# EAGLE design BackPlane (EAGLE 9.6.2)
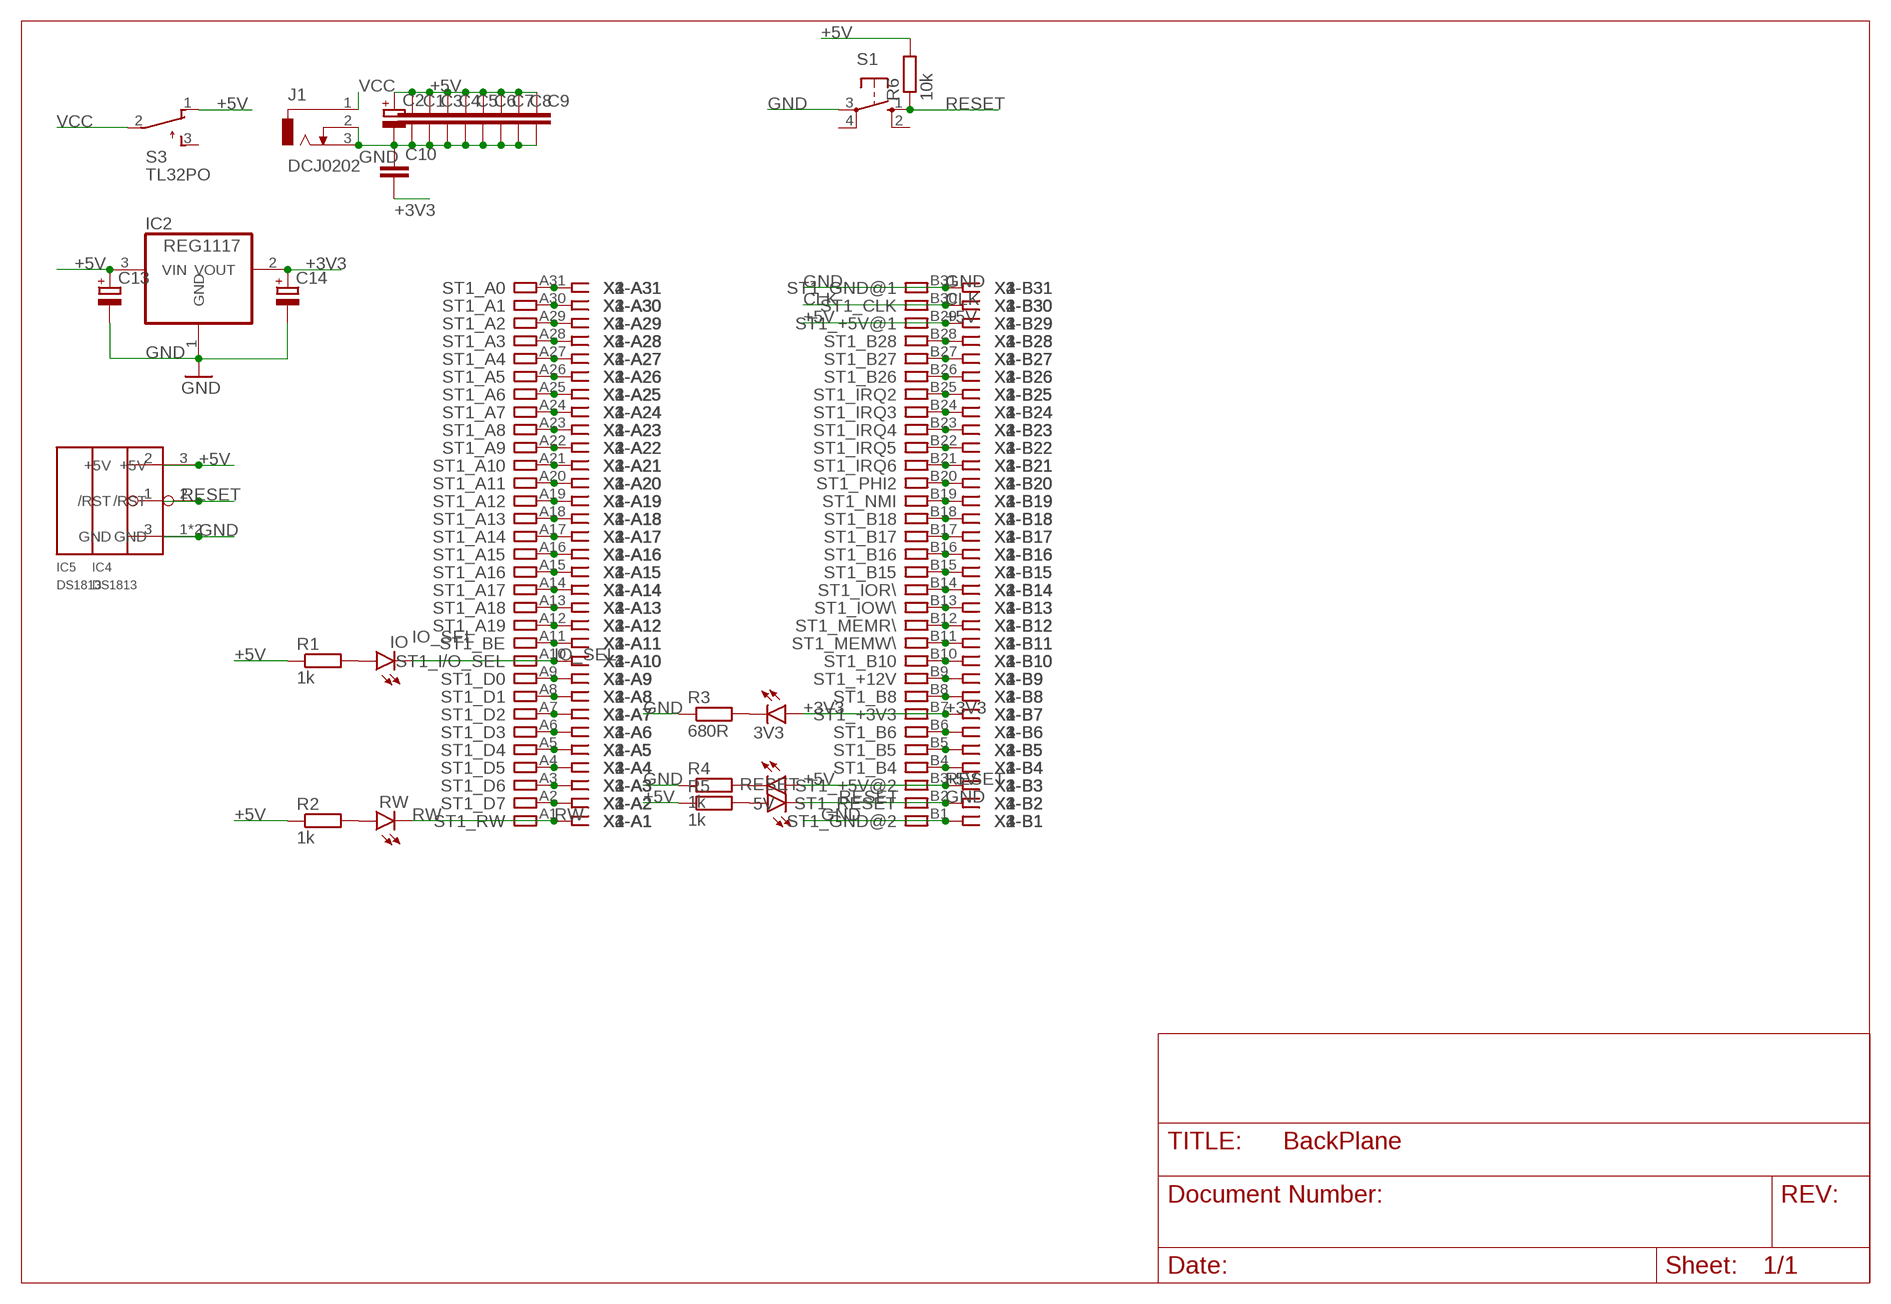
[diagram p0: schematic, sheet 1]

## Parts
3V3  LED3MM  [LED3MM]
5V  LED3MM  [LED3MM]
C1  C-EU050-024X044  [C050-024X044]
C2  CPOL-EUE3.5-8  [E3,5-8]
C3  C-EU050-024X044  [C050-024X044]
C4  C-EU050-024X044  [C050-024X044]
C5  C-EU050-024X044  [C050-024X044]
C6  C-EU050-024X044  [C050-024X044]
C7  C-EU050-024X044  [C050-024X044]
C8  C-EU050-024X044  [C050-024X044]
C9  C-EU050-024X044  [C050-024X044]
C10  C-EU025-024X044  [C025-024X044]
C13  CPOL-EUE2.5-5  [E2,5-5]
C14  CPOL-EUE2.5-5  [E2,5-5]
IC2  REG1117  [SOT223]
IC4  DS1813  DS1813SOT-223  [SOT223]
IC5  DS1813  [TO-92]
IO  LED3MM  [LED3MM]
J1  DCJ0202  [DCJ0202]
R1  1k  R-EU_0207/7  [0207/7]
R2  1k  R-EU_0207/7  [0207/7]
R3  680R  R-EU_0207/7  [0207/7]
R4  1k  R-EU_0207/7  [0207/7]
R5  1k  R-EU_0207/7  [0207/7]
R6  10k  R-EU_0207/7  [0207/7]
RESET  LED3MM  [LED3MM]
RW  LED3MM  [LED3MM]
S1  10-XX  [B3F-10XX]
S3  TL32PO  [TL3XPO]
ST1  IBM8BIT_ISASHORT  [APP_2X32_SHORT]
X1  ISA-SLOT  [ISA-8]
X2  ISA-SLOT  [ISA-8]
X3  ISA-SLOT  [ISA-8]
X4  ISA-SLOT  [ISA-8]

## Nets
+3V3: 3V3.A C10.2 C14.+ IC2.2(VOUT) ST1.B7 X1.B7 X2.B7 X3.B7 X4.B7
+5V: 5V.A C1.1 C2.+ C3.1 C4.1 C5.1 C6.1 C7.1 C8.1 C9.1 C13.+ IC2.3(VIN) IC4.3(+5V) IC5.2(+5V) R1.1 R2.1 R5.1 R6.2 S3.1(O) ST1.B3 ST1.B29 X1.B3 X1.B29 X2.B3 X2.B29 X3.B3 X3.B29 X4.B3 X4.B29
CLK: ST1.B30 X1.B30 X2.B30 X3.B30 X4.B30
GND: C1.2 C2.- C3.2 C4.2 C5.2 C6.2 C7.2 C8.2 C9.2 C10.1 C13.- C14.- IC2.1(GND) IC4.1(GND) IC4.4(GND) IC5.3(GND) J1.2 J1.3 R3.1 R4.1 S1.3(P) ST1.B1 ST1.B31 X1.B1 X1.B31 X2.B1 X2.B31 X3.B1 X3.B31 X4.B1 X4.B31
IO_SEL: IO.K(C) ST1.A10 X1.A10 X2.A10 X3.A10 X4.A10
N$1: IO.A R1.2
N$2: ST1.A2 X1.A2 X2.A2 X3.A2 X4.A2
N$3: ST1.A3 X1.A3 X2.A3 X3.A3 X4.A3
N$4: ST1.A4 X1.A4 X2.A4 X3.A4 X4.A4
N$5: ST1.A5 X1.A5 X2.A5 X3.A5 X4.A5
N$6: ST1.A6 X1.A6 X2.A6 X3.A6 X4.A6
N$7: ST1.A7 X1.A7 X2.A7 X3.A7 X4.A7
N$8: ST1.A8 X1.A8 X2.A8 X3.A8 X4.A8
N$9: ST1.A9 X1.A9 X2.A9 X3.A9 X4.A9
N$10: R2.2 RW.A
N$12: ST1.A11 X1.A11 X2.A11 X3.A11 X4.A11
N$13: ST1.A12 X1.A12 X2.A12 X3.A12 X4.A12
N$14: ST1.A13 X1.A13 X2.A13 X3.A13 X4.A13
N$15: ST1.A14 X1.A14 X2.A14 X3.A14 X4.A14
N$16: ST1.A15 X1.A15 X2.A15 X3.A15 X4.A15
N$17: ST1.A16 X1.A16 X2.A16 X3.A16 X4.A16
N$18: ST1.A17 X1.A17 X2.A17 X3.A17 X4.A17
N$19: ST1.A18 X1.A18 X2.A18 X3.A18 X4.A18
N$20: ST1.A19 X1.A19 X2.A19 X3.A19 X4.A19
N$21: ST1.A20 X1.A20 X2.A20 X3.A20 X4.A20
N$22: ST1.A21 X1.A21 X2.A21 X3.A21 X4.A21
N$23: ST1.A22 X1.A22 X2.A22 X3.A22 X4.A22
N$24: ST1.A23 X1.A23 X2.A23 X3.A23 X4.A23
N$25: ST1.A24 X1.A24 X2.A24 X3.A24 X4.A24
N$26: ST1.A25 X1.A25 X2.A25 X3.A25 X4.A25
N$27: ST1.A26 X1.A26 X2.A26 X3.A26 X4.A26
N$28: ST1.A27 X1.A27 X2.A27 X3.A27 X4.A27
N$29: ST1.A28 X1.A28 X2.A28 X3.A28 X4.A28
N$30: ST1.A29 X1.A29 X2.A29 X3.A29 X4.A29
N$31: ST1.A30 X1.A30 X2.A30 X3.A30 X4.A30
N$32: ST1.A31 X1.A31 X2.A31 X3.A31 X4.A31
N$35: ST1.B4 X1.B4 X2.B4 X3.B4 X4.B4
N$36: ST1.B5 X1.B5 X2.B5 X3.B5 X4.B5
N$37: ST1.B6 X1.B6 X2.B6 X3.B6 X4.B6
N$39: ST1.B8 X1.B8 X2.B8 X3.B8 X4.B8
N$40: ST1.B9 X1.B9 X2.B9 X3.B9 X4.B9
N$41: ST1.B10 X1.B10 X2.B10 X3.B10 X4.B10
N$42: ST1.B11 X1.B11 X2.B11 X3.B11 X4.B11
N$43: ST1.B12 X1.B12 X2.B12 X3.B12 X4.B12
N$44: ST1.B13 X1.B13 X2.B13 X3.B13 X4.B13
N$45: ST1.B14 X1.B14 X2.B14 X3.B14 X4.B14
N$46: ST1.B15 X1.B15 X2.B15 X3.B15 X4.B15
N$47: ST1.B16 X1.B16 X2.B16 X3.B16 X4.B16
N$48: ST1.B17 X1.B17 X2.B17 X3.B17 X4.B17
N$49: ST1.B18 X1.B18 X2.B18 X3.B18 X4.B18
N$50: ST1.B19 X1.B19 X2.B19 X3.B19 X4.B19
N$51: ST1.B20 X1.B20 X2.B20 X3.B20 X4.B20
N$52: ST1.B21 X1.B21 X2.B21 X3.B21 X4.B21
N$53: ST1.B22 X1.B22 X2.B22 X3.B22 X4.B22
N$54: ST1.B23 X1.B23 X2.B23 X3.B23 X4.B23
N$55: ST1.B24 X1.B24 X2.B24 X3.B24 X4.B24
N$56: ST1.B25 X1.B25 X2.B25 X3.B25 X4.B25
N$57: ST1.B26 X1.B26 X2.B26 X3.B26 X4.B26
N$58: ST1.B27 X1.B27 X2.B27 X3.B27 X4.B27
N$59: ST1.B28 X1.B28 X2.B28 X3.B28 X4.B28
N$63: 3V3.K(C) R3.2
N$64: 5V.K(C) R4.2
N$68: R5.2 RESET.A
RESET: IC4.2(/RST) IC5.1(/RST) R6.1 RESET.K(C) S1.1(S) ST1.B2 X1.B2 X2.B2 X3.B2 X4.B2
RW: RW.K(C) ST1.A1 X1.A1 X2.A1 X3.A1 X4.A1
VCC: J1.1 S3.2(P)
Unconnected: S1.2(S1) S1.4(P1) S3.3(S)

## Library data of the parts
3V3 5V IO RESET RW = led:LED: LED OSRAM: - CHIPLED LG R971, LG N971, LY N971, LG Q971, LY Q971, LO R971, LY R971 LH N974, LH R974 LS Q976, LO Q976, LY Q976 LO Q996 - Hyper CHIPLED LW Q18S LB Q993, LB Q99A, LB R99A - SideLED LS A670, LO A670, LY A670, LG A670, LP A670 LB A673, LV A673, LT A673, LW A673 LH A674 LY A675 LS A676, LA A676, LO A676, LY A676, LW A676 LS A679, LY A679, LG A679 - Hyper Micro SIDELED® LS Y876, LA Y876, LO Y876, LY Y876 LT Y87S - SmartLED LW L88C, LW L88S LB L89C, LB L89S, LG L890 LS L89K, LO L89K, LY L89K LS L896, LA L896, LO L896, LY L896 - TOPLED LS T670, LO T670, LY T670, LG T670, LP T670 LSG T670, LSP T670, LSY T670, LOP T670, LYG T670 LG T671, LOG T671, LSG T671 LB T673, LV T673, LT T673, LW T673 LH T674 LS T676, LA T676, LO T676, LY T676, LB T676, LH T676, LSB T676, LW T676 LB T67C, LV T67C, LT T67C, LS T67K, LO T67K, LY T67K, LW E67C LS E67B, LA E67B, LO E67B, LY E67B, LB E67C, LV E67C, LT E67C LW T67C LS T679, LY T679, LG T679 LS T770, LO T770, LY T770, LG T770, LP T770 LB T773, LV T773, LT T773, LW T773 LH T774 LS E675, LA E675, LY E675, LS T675 LS T776, LA T776, LO T776, LY T776, LB T776 LHGB T686 LT T68C, LB T68C - Hyper Mini TOPLED® LB M676 - Mini TOPLED Santana® LG M470 LS M47K, LO M47K, LY M47K Source: http://www.osram.convergy.de LUXEON: - LUMILED® LXK2-PW12-R00, LXK2-PW12-S00, LXK2-PW14-U00, LXK2-PW14-V00 LXK2-PM12-R00, LXK2-PM12-S00, LXK2-PM14-U00 LXK2-PE12-Q00, LXK2-PE12-R00, LXK2-PE12-S00, LXK2-PE14-T00, LXK2-PE14-U00 LXK2-PB12-K00, LXK2-PB12-L00, LXK2-PB12-M00, LXK2-PB14-N00, LXK2-PB14-P00, LXK2-PB14-Q00 LXK2-PR12-L00, LXK2-PR12-M00, LXK2-PR14-Q00, LXK2-PR14-R00 LXK2-PD12-Q00, LXK2-PD12-R00, LXK2-PD12-S00 LXK2-PH12-R00, LXK2-PH12-S00 LXK2-PL12-P00, LXK2-PL12-Q00, LXK2-PL12-R00 Source: www.luxeon.com KINGBRIGHT: KA-3528ASYC Source: www.kingbright.com
C1 C3-C10 = rcl:C-EU: CAPACITOR, European symbol; SPICEPREFIX: C
C2 C13 C14 = rcl:CPOL-EU: POLARIZED CAPACITOR, European symbol; SPICEPREFIX: C
IC2 = burr-brown:REG1117: 800mA and 1A Low Dropout (LDO) Positive Regulator 1.8V, 2.5V, 2.85V, 3.3V, 5V, and Adj; MPN: REG1117; OC_FARNELL: 1097566; OC_NEWARK: 14P6981
IC4 IC5 = ds1813_revised:DS1813
J1 = con-jack:DCJ0202: DC POWER JACK Source: DCJ0202.pdf; OC_FARNELL: unknown; OC_NEWARK: unknown
R1-R6 = rcl:R-EU_: RESISTOR, European symbol; SPICEPREFIX: R
S1 = switch-omron:10-XX: OMRON SWITCH; MPN: B3F-1000; OC_FARNELL: 176432; OC_NEWARK: 36M3542
S3 = switch:TL32PO: TINY SWITCH ON - MOM Source: http://www2.produktinfo.conrad.com/datenblaetter/700000-724999/705152-da-01-de-Subminiaturschalter_TL_36YO.pdf
ST1 = TiRoRiN_Libs:IBM8BIT_ISA: 8-bit CARD IBM/PC-AT
X1-X4 = TiRoRiN_Libs:ISA-SLOT: ISA SLOT

## Net classes
0 default: width 0.203 mm, drill 0.66 mm, clearance 0.254 mm
1 power: width 0.203 mm, drill 0.66 mm, clearance 0.254 mm to class 0, clearance 0.381 mm
2 data: width 0.381 mm, drill 0.66 mm, clearance 0.254 mm to class 0, clearance 0.254 mm to class 1, clearance 0.254 mm

## Board
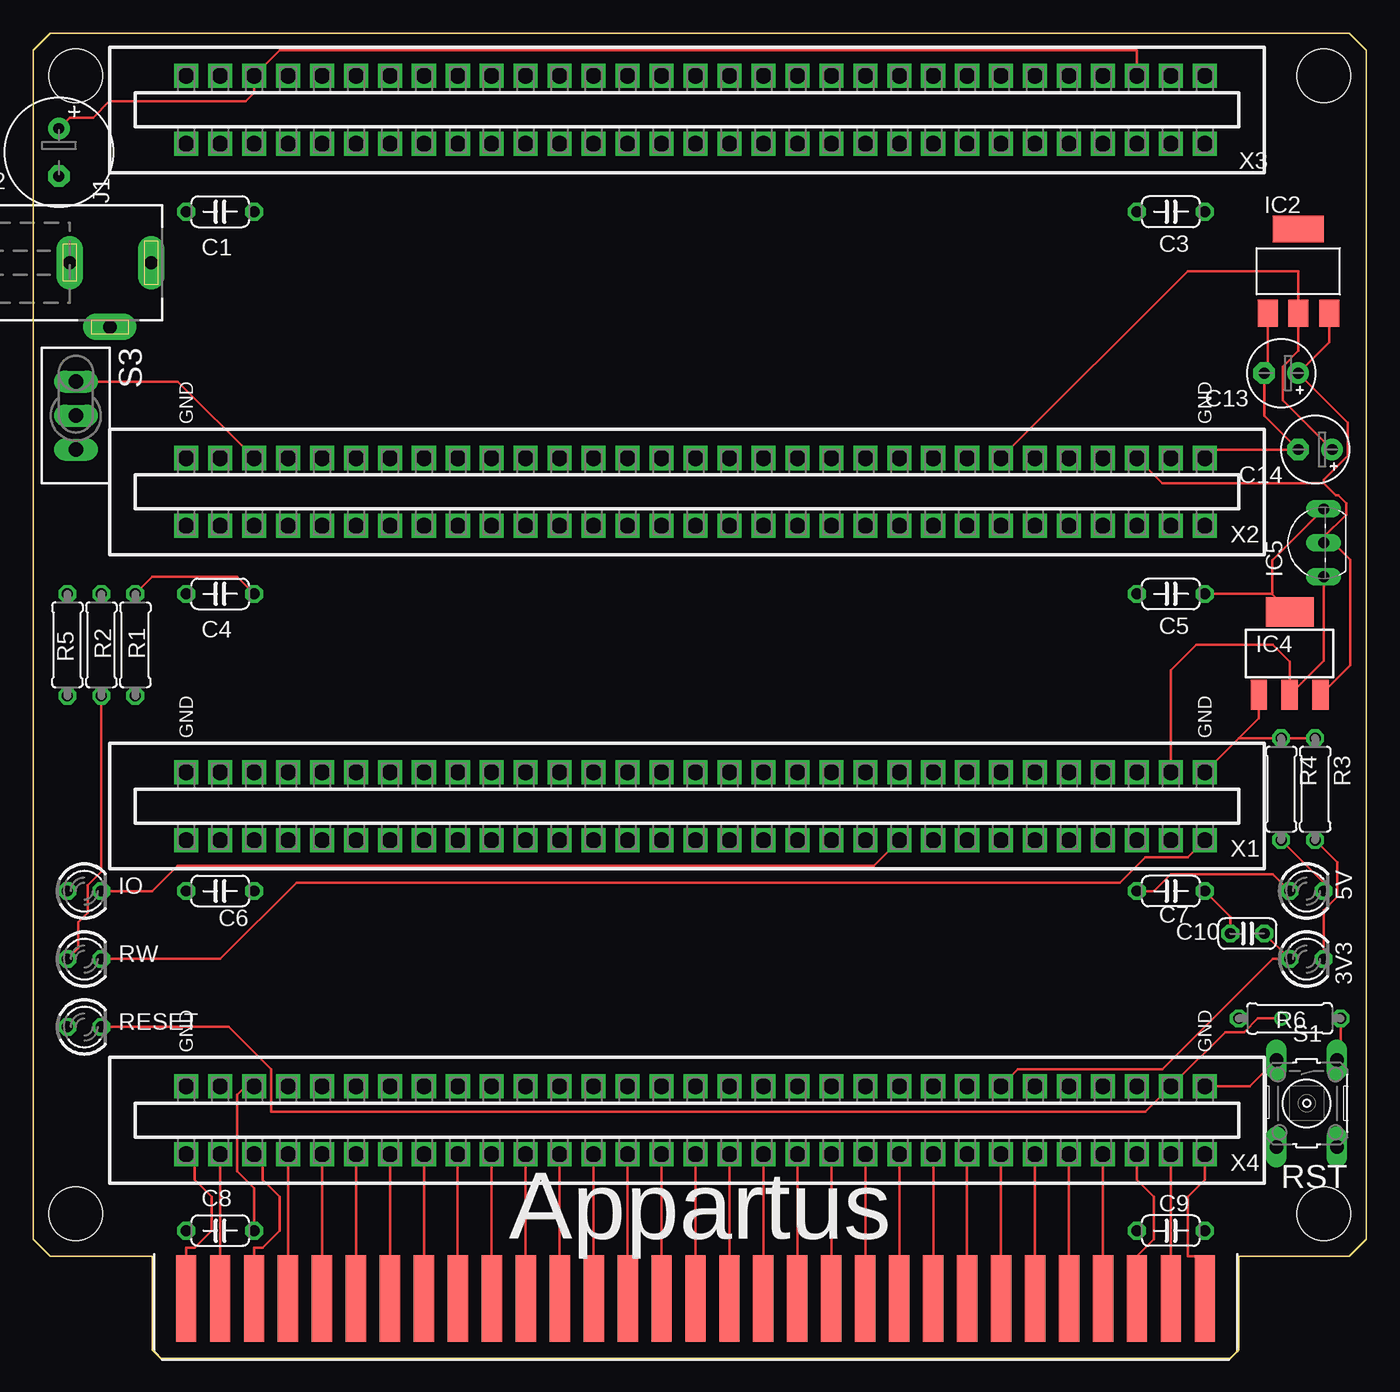
[diagram p1: board, top side]
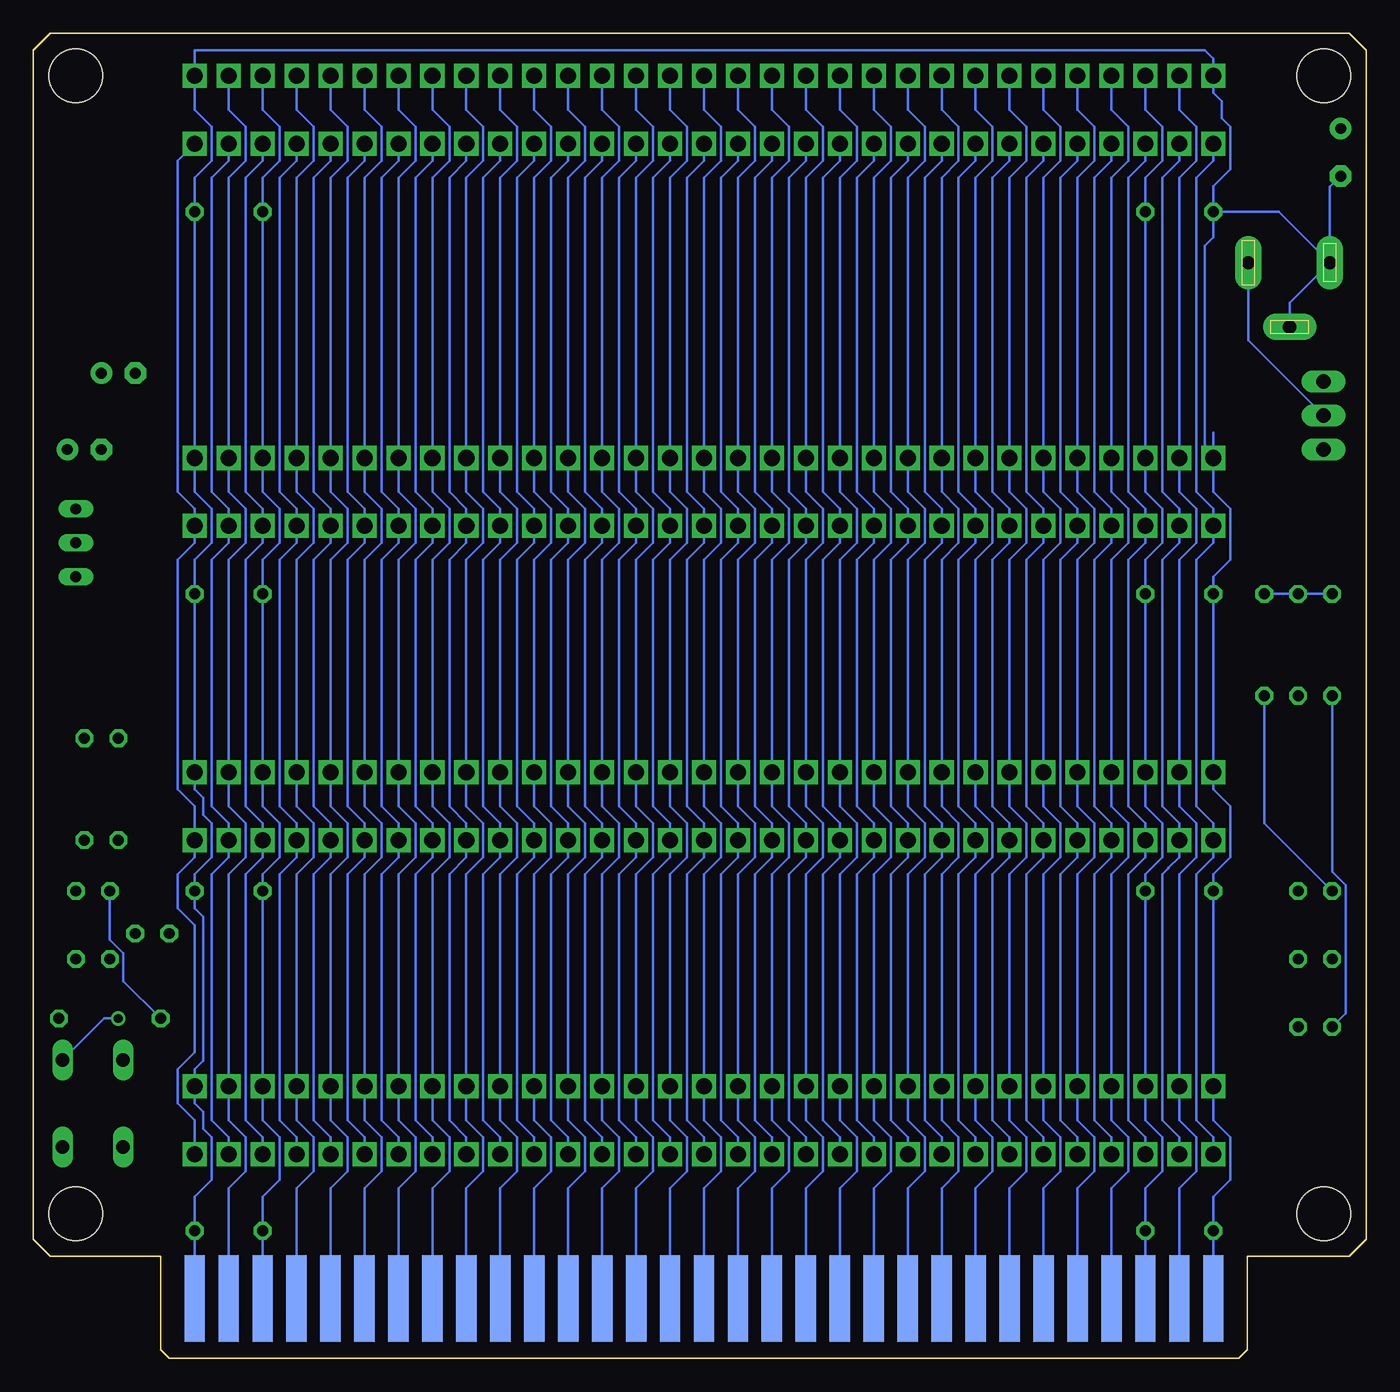
[diagram p2: board, bottom side, seen from below]

Size 99.69 x 99.06 mm. Coordinates in mm from the lower left corner, seen from the top.
Copper layers (1*16): Top 0.035mm / dielectric 1.5mm / Bottom 0.035mm
Design rules "default": minimum track width 6mil, minimum drill 0.35mm, track to track 6mil, track to pad 6mil, pad to pad 6mil, via to via 6mil, smd to smd 6mil, copper to edge 40mil, drill to drill 6mil, minimum pad ring 10mil, minimum via ring 8mil, stop-mask expansion 4mil, vias tented up to drill 0mil, thermal gap 10mil
Holes 4 mm at 3.17,95.88 96.52,95.88 96.52,10.8 3.17,10.8

### Footprints (pad centres in the part's own frame; a part is rotated, then mirrored left to right if it is on the bottom)
LED3MM = drill 0.813 octagon: A -1.27,0; K 1.27,0
C050-024X044 = drill 0.813 octagon: 1 -2.54,0; 2 2.54,0
E3,5-8 = drill 0.813 pad 1.6: + -1.778,0 | drill 0.813 pad 1.6 octagon: - 1.778,0
C025-024X044 = drill 0.813 octagon: 1 -1.27,0; 2 1.27,0
E2,5-5 = drill 0.813 pad 1.6: + -1.27,0 | drill 0.813 pad 1.6 octagon: - 1.27,0
SOT223 = smd 1.499 x 2.007: 1 -2.261,-3.15; 2 0.025,-3.15; 3 2.311,-3.15 | smd 3.81 x 2.007: 4 0,3.15
SOT223' = smd 1.219 x 2.235: 1 -2.311,-3.099; 2 0,-3.099; 3 2.311,-3.099 | smd 3.6 x 2.2: 4 0,3.099
TO-92 = drill 0.813 long: 1 -2.54,0; 2 0,0; 3 2.54,0
DCJ0202 = drill 1 pad 2 long: 1 0,3.1; 2 4.8,0; 3 0,-3
0207/7 = drill 0.813 octagon: 1 -3.81,0; 2 3.81,0
B3F-10XX = drill 1.016 long: 1 -3.251,2.261; 2 3.251,2.261; 3 -3.251,-2.261; 4 3.251,-2.261
TL3XPO = drill 1.1 pad 1.422 long: 1 -2.54,0; 2 0,0; 3 2.54,0
APP_2X32_SHORT = smd 1.524 x 6.477: A1 38.1,-44.45; A2 35.56,-44.45; A3 33.02,-44.45; A4 30.48,-44.45; A5 27.94,-44.45; A6 25.4,-44.45; A7 22.86,-44.45; A8 20.32,-44.45; A9 17.78,-44.45; A10 15.24,-44.45; A11 12.7,-44.45; A12 10.16,-44.45; A13 7.62,-44.45; A14 5.08,-44.45; A15 2.54,-44.45; A16 0,-44.45; A17 -2.54,-44.45; A18 -5.08,-44.45; A19 -7.62,-44.45; A20 -10.16,-44.45; A21 -12.7,-44.45; A22 -15.24,-44.45; A23 -17.78,-44.45; A24 -20.32,-44.45; A25 -22.86,-44.45; A26 -25.4,-44.45; A27 -27.94,-44.45; A28 -30.48,-44.45; A29 -33.02,-44.45; A30 -35.56,-44.45; A31 -38.1,-44.45 | smd 1.524 x 6.477 bottom: B1 38.1,-44.45; B2 35.56,-44.45; B3 33.02,-44.45; B4 30.48,-44.45; B5 27.94,-44.45; B6 25.4,-44.45; B7 22.86,-44.45; B8 20.32,-44.45; B9 17.78,-44.45; B10 15.24,-44.45; B11 12.7,-44.45; B12 10.16,-44.45; B13 7.62,-44.45; B14 5.08,-44.45; B15 2.54,-44.45; B16 0,-44.45; B17 -2.54,-44.45; B18 -5.08,-44.45; B19 -7.62,-44.45; B20 -10.16,-44.45; B21 -12.7,-44.45; B22 -15.24,-44.45; B23 -17.78,-44.45; B24 -20.32,-44.45; B25 -22.86,-44.45; B26 -25.4,-44.45; B27 -27.94,-44.45; B28 -30.48,-44.45; B29 -33.02,-44.45; B30 -35.56,-44.45; B31 -38.1,-44.45
ISA-8 = drill 1.2 pad 1.778 square: A1 40.64,-2.54; A2 38.1,-2.54; A3 35.56,-2.54; A4 33.02,-2.54; A5 30.48,-2.54; A6 27.94,-2.54; A7 25.4,-2.54; A8 22.86,-2.54; A9 20.32,-2.54; A10 17.78,-2.54; A11 15.24,-2.54; A12 12.7,-2.54; A13 10.16,-2.54; A14 7.62,-2.54; A15 5.08,-2.54; A16 2.54,-2.54; A17 0,-2.54; A18 -2.54,-2.54; A19 -5.08,-2.54; A20 -7.62,-2.54; A21 -10.16,-2.54; A22 -12.7,-2.54; A23 -15.24,-2.54; A24 -17.78,-2.54; A25 -20.32,-2.54; A26 -22.86,-2.54; A27 -25.4,-2.54; A28 -27.94,-2.54; A29 -30.48,-2.54; A30 -33.02,-2.54; A31 -35.56,-2.54; B1 40.64,2.54; B2 38.1,2.54; B3 35.56,2.54; B4 33.02,2.54; B5 30.48,2.54; B6 27.94,2.54; B7 25.4,2.54; B8 22.86,2.54; B9 20.32,2.54; B10 17.78,2.54; B11 15.24,2.54; B12 12.7,2.54; B13 10.16,2.54; B14 7.62,2.54; B15 5.08,2.54; B16 2.54,2.54; B17 0,2.54; B18 -2.54,2.54; B19 -5.08,2.54; B20 -7.62,2.54; B21 -10.16,2.54; B22 -12.7,2.54; B23 -15.24,2.54; B24 -17.78,2.54; B25 -20.32,2.54; B26 -22.86,2.54; B27 -25.4,2.54; B28 -27.94,2.54; B29 -30.48,2.54; B30 -33.02,2.54; B31 -35.56,2.54

### Placement (x,y rotation side)
3V3  95.25,29.84 0 top
5V  95.25,34.93 0 top
C1  13.97,85.72 180 top
C2  1.9,90.17 270 top
C3  85.09,85.72 0 top
C4  13.97,57.15 180 top
C5  85.09,57.15 0 top
C6  13.97,34.93 180 top
C7  85.09,34.93 0 top
C8  13.97,9.53 180 top
C9  85.09,9.53 0 top
C10  90.81,31.75 0 top
C13  93.34,73.66 180 top
C14  95.88,67.94 180 top
IC2  94.62,81.28 0 top
IC4  DS1813  [SOT223']  93.98,52.7 0 top
IC5  96.52,60.96 90 top
IO  3.81,34.93 0 top
J1  5.71,81.91 270 top
R1  7.62,53.34 270 top
R2  5.08,53.34 270 top
R3  95.88,42.55 270 top
R4  93.34,42.55 270 top
R5  2.54,53.34 270 top
R6  93.98,25.4 180 top
RESET  3.81,24.77 0 top
RW  3.81,29.84 0 top
S1  95.25,19.05 270 top
S3  3.17,70.49 270 top
ST1  49.53,48.9 0 top
X1  46.99,41.27 0 top
X2  46.99,64.77 0 top
X3  46.99,93.34 0 top
X4  46.99,17.78 0 top

### Tracks (layer width: path | path; a pad name or v marks a point on that pad's centre or on a via)
+3V3
  Top 0.203: X4.B7 73.66,21.59 84.46,21.59 92.71,29.84 3V3.A C10.2 | X2.B7 86.36,81.28 94.62,81.28 94.64,81.25 IC2.2 94.64,75.32 93.46,74.14 93.46,71.64 C14.+
  Bottom 0.203: ST1.B7 72.39,12.7 71.12,13.97 71.12,16.51 72.39,17.78 X4.B7 72.39,36.2 71.12,37.47 71.12,40.01 72.39,41.27 X1.B7 72.39,59.69 71.12,60.96 71.12,63.5 72.39,64.77 X2.B7 72.39,88.27 71.12,89.53 71.12,92.07 72.39,93.34 X3.B7
+5V
  Top 0.203: 5V.A 92.71,36.2 85.09,36.2 83.82,34.93 C7.1 | C8.1 16.51,12.7 15.24,13.97 15.24,19.69 15.88,20.32 X4.B29 | X3.B3 82.55,97.79 18.41,97.79 17.14,96.52 17.14,95.88 X3.B29 16.51,94.62 15.88,93.98 5.68,93.98 4.47,92.77 2.72,92.77 C2.+ | R1.1 8.89,58.42 15.24,58.42 C4.1 | IC2.3 96.93,75.97 C13.+ 98.31,69.96 98.31,67.47 96.52,65.68 96.52,65.41 | X2.B3 84.46,65.41 96.52,65.41 | S3.1 10.79,73.03 X2.B29 | 96.52,65.41 97.41,64.52 97.6,64.52 98.2,63.92 98.2,63.08 96.52,61.4 IC5.2 97.24,60.96 98.51,59.69 98.51,51.83 IC4.3
  Bottom 0.203: ST1.B3 C9.1 82.55,12.07 81.28,13.34 81.28,16.51 82.55,17.78 X4.B3 C7.1 82.55,36.2 81.28,37.47 81.28,40.01 82.55,41.27 X1.B3 C5.1 82.55,59.69 81.28,60.96 81.28,63.5 82.55,64.77 X2.B3 C3.1 82.55,88.27 81.28,89.53 81.28,92.07 82.55,93.34 X3.B3 | ST1.B29 16.51,12.7 15.24,13.97 15.24,16.51 16.51,17.78 X4.B29 C6.1 16.51,36.2 15.24,37.47 15.24,40.01 16.51,41.27 X1.B29 C4.1 16.51,59.69 15.24,60.96 15.24,63.5 16.51,64.77 X2.B29 C1.1 16.51,88.27 15.24,89.53 15.24,92.07 16.51,93.34 X3.B29 | R6.2 92.96,28.19 92.96,30.27 93.98,31.28 5V.A | R5.1 R2.1 R1.1
CLK
  Bottom 0.203: ST1.B30 13.97,12.7 12.7,13.97 12.7,16.51 13.97,17.78 X4.B30 13.97,36.2 12.7,37.47 12.7,40.01 13.97,41.27 X1.B30 13.97,59.69 12.7,60.96 12.7,63.5 13.97,64.77 X2.B30 13.97,88.27 12.7,89.53 12.7,92.07 13.97,93.34 X3.B30
GND
  Top 0.203: C7.2 89.53,33.02 C10.1 | S1.3 91.01,20.32 X4.B1 | IC2.1 92.35,73.94 C13.- 92.07,70.49 C14.- 88.26,67.94 X2.B1 | X1.B1 90.17,46.36 | 90.17,46.36 R4.1 R3.1 | C5.2 92.63,57.15 92.67,57.11 | 92.67,57.11 IC4.4 | IC5.3 92.67,59.65 92.67,57.11 | IC4.1 91.67,47.85 90.17,46.36
  Bottom 0.203: ST1.B31 C8.2 11.43,12.07 10.16,13.34 10.16,16.51 11.43,17.78 X4.B31 C6.2 11.43,36.2 10.16,37.47 10.16,41.27 11.43,42.55 X1.B31 C4.2 11.43,58.42 10.16,59.69 10.16,63.5 11.43,64.77 X2.B31 | X2.B31 11.43,69.22 | X2.B1 87.63,64.77 86.36,63.5 86.36,60.96 87.63,59.69 C5.2 X1.B1 87.63,42.55 87,41.91 87,40.64 86.36,40.01 86.36,37.47 87.63,36.2 C7.2 87.63,33.66 87,33.02 87,22.23 87.63,21.59 X4.B1 87.63,19.05 87,18.41 87,17.14 86.36,16.51 86.36,13.34 87.63,12.07 C9.2 ST1.B1 | X2.B1 87.63,67.94 | C1.2 11.43,87.63 10.16,88.9 10.16,92.07 10.79,92.71 10.79,93.98 11.43,94.62 X3.B31 11.43,97.16 12.06,97.79 87.63,97.79 X3.B1 87.63,93.34 86.36,92.07 86.36,89.53 87.63,88.27 C3.2 X2.B1 | X2.B31 12.06,67.94 12.06,83.19 11.43,83.82 C1.2 | J1.2 5.71,78.91 J1.3 | J1.3 2.71,87.58 C2.- | J1.3 6.52,85.72 C1.2
IO_SEL
  Top 0.203: IO.K 8.89,34.93 10.79,36.83 62.87,36.83 X1.A10 | X4.A10 ST1.A10
  Bottom 0.203: X4.A10 64.77,16.51 66.04,17.78 66.04,36.2 64.77,37.47 X1.A10 64.77,40.01 66.04,41.27 66.04,59.69 64.77,60.96 X2.A10 64.77,63.5 66.04,64.77 66.04,88.27 64.77,89.53 X3.A10
N$1
  Bottom 0.203: R1.2 7.62,40.01 IO.A
N$2
  Top 0.203: X4.A2 ST1.A2
  Bottom 0.203: X4.A2 85.09,16.51 86.36,17.78 86.36,36.2 85.09,37.47 X1.A2 85.09,40.01 86.36,41.27 86.36,59.69 85.09,60.96 X2.A2 85.09,63.5 86.36,64.77 86.36,88.27 85.09,89.53 X3.A2
N$3
  Top 0.203: ST1.A3 82.55,7.62 83.82,8.89 83.82,12.07 82.55,13.34 X4.A3
  Bottom 0.203: X4.A3 82.55,16.51 83.82,17.78 83.82,36.2 82.55,37.47 X1.A3 82.55,40.01 83.82,41.27 83.82,59.69 82.55,60.96 X2.A3 82.55,63.5 83.82,64.77 83.82,88.27 82.55,89.53 X3.A3
N$4
  Top 0.203: X4.A4 ST1.A4
  Bottom 0.203: X4.A4 80.01,16.51 81.28,17.78 81.28,36.2 80.01,37.47 X1.A4 80.01,40.01 81.28,41.27 81.28,59.69 80.01,60.96 X2.A4 80.01,63.5 81.28,64.77 81.28,88.27 80.01,89.53 X3.A4
N$5
  Top 0.203: X4.A5 ST1.A5
  Bottom 0.203: X4.A5 77.47,16.51 78.74,17.78 78.74,36.2 77.47,37.47 X1.A5 77.47,40.01 78.74,41.27 78.74,59.69 77.47,60.96 X2.A5 77.47,63.5 78.74,64.77 78.74,88.27 77.47,89.53 X3.A5
N$6
  Top 0.203: X4.A6 ST1.A6
  Bottom 0.203: X4.A6 74.93,16.51 76.2,17.78 76.2,36.2 74.93,37.47 X1.A6 74.93,40.01 76.2,41.27 76.2,59.69 74.93,60.96 X2.A6 74.93,63.5 76.2,64.77 76.2,88.27 74.93,89.53 X3.A6
N$7
  Top 0.203: X4.A7 ST1.A7
  Bottom 0.203: X4.A7 72.39,16.51 73.66,17.78 73.66,36.2 72.39,37.47 X1.A7 72.39,40.01 73.66,41.27 73.66,59.69 72.39,60.96 X2.A7 72.39,63.5 73.66,64.77 73.66,88.27 72.39,89.53 X3.A7
N$8
  Top 0.203: X4.A8 ST1.A8
  Bottom 0.203: X4.A8 69.85,16.51 71.12,17.78 71.12,36.2 69.85,37.47 X1.A8 69.85,40.01 71.12,41.27 71.12,59.69 69.85,60.96 X2.A8 69.85,63.5 71.12,64.77 71.12,88.27 69.85,89.53 X3.A8
N$9
  Top 0.203: X4.A9 ST1.A9
  Bottom 0.203: X4.A9 67.31,16.51 68.58,17.78 68.58,36.2 67.31,37.47 X1.A9 67.31,40.01 68.58,41.27 68.58,59.69 67.31,60.96 X2.A9 67.31,63.5 68.58,64.77 68.58,88.27 67.31,89.53 X3.A9
N$10
  Top 0.203: RW.A 3.35,30.66 3.35,32.57 4.06,33.29 4.06,35.35 5.08,36.36 R2.2
N$12
  Top 0.203: X4.A11 ST1.A11
  Bottom 0.203: X4.A11 62.23,16.51 63.5,17.78 63.5,36.2 62.23,37.47 X1.A11 62.23,40.01 63.5,41.27 63.5,59.69 62.23,60.96 X2.A11 62.23,63.5 63.5,64.77 63.5,88.27 62.23,89.53 X3.A11
N$13
  Top 0.203: X4.A12 ST1.A12
  Bottom 0.203: X4.A12 59.69,16.51 60.96,17.78 60.96,36.2 59.69,37.47 X1.A12 59.69,40.01 60.96,41.27 60.96,59.69 59.69,60.96 X2.A12 59.69,63.5 60.96,64.77 60.96,88.27 59.69,89.53 X3.A12
N$14
  Top 0.203: X4.A13 ST1.A13
  Bottom 0.203: X4.A13 57.15,16.51 58.42,17.78 58.42,36.2 57.15,37.47 X1.A13 57.15,40.01 58.42,41.27 58.42,59.69 57.15,60.96 X2.A13 57.15,63.5 58.42,64.77 58.42,88.27 57.15,89.53 X3.A13
N$15
  Top 0.203: X4.A14 ST1.A14
  Bottom 0.203: X4.A14 54.61,16.51 55.88,17.78 55.88,36.2 54.61,37.47 X1.A14 54.61,40.01 55.88,41.27 55.88,59.69 54.61,60.96 X2.A14 54.61,63.5 55.88,64.77 55.88,88.27 54.61,89.53 X3.A14
N$16
  Top 0.203: X4.A15 ST1.A15
  Bottom 0.203: X4.A15 52.07,16.51 53.34,17.78 53.34,36.2 52.07,37.47 X1.A15 52.07,40.01 53.34,41.27 53.34,59.69 52.07,60.96 X2.A15 52.07,63.5 53.34,64.77 53.34,88.27 52.07,89.53 X3.A15
N$17
  Top 0.203: X4.A16 ST1.A16
  Bottom 0.203: X4.A16 49.53,16.51 50.8,17.78 50.8,36.2 49.53,37.47 X1.A16 49.53,40.01 50.8,41.27 50.8,59.69 49.53,60.96 X2.A16 49.53,63.5 50.8,64.77 50.8,88.27 49.53,89.53 X3.A16
N$18
  Top 0.203: X4.A17 ST1.A17
  Bottom 0.203: X4.A17 46.99,16.51 48.26,17.78 48.26,36.2 46.99,37.47 X1.A17 46.99,40.01 48.26,41.27 48.26,59.69 46.99,60.96 X2.A17 46.99,63.5 48.26,64.77 48.26,88.27 46.99,89.53 X3.A17
N$19
  Top 0.203: X4.A18 ST1.A18
  Bottom 0.203: X4.A18 44.45,16.51 45.72,17.78 45.72,36.2 44.45,37.47 X1.A18 44.45,40.01 45.72,41.27 45.72,59.69 44.45,60.96 X2.A18 44.45,63.5 45.72,64.77 45.72,88.27 44.45,89.53 X3.A18
N$20
  Top 0.203: X4.A19 ST1.A19
  Bottom 0.203: X4.A19 41.91,16.51 43.18,17.78 43.18,36.2 41.91,37.47 X1.A19 41.91,40.01 43.18,41.27 43.18,59.69 41.91,60.96 X2.A19 41.91,63.5 43.18,64.77 43.18,88.27 41.91,89.53 X3.A19
N$21
  Top 0.203: X4.A20 ST1.A20
  Bottom 0.203: X4.A20 39.37,16.51 40.64,17.78 40.64,36.2 39.37,37.47 X1.A20 39.37,40.01 40.64,41.27 40.64,59.69 39.37,60.96 X2.A20 39.37,63.5 40.64,64.77 40.64,88.27 39.37,89.53 X3.A20
N$22
  Top 0.203: X4.A21 ST1.A21
  Bottom 0.203: X4.A21 36.83,16.51 38.1,17.78 38.1,36.2 36.83,37.47 X1.A21 36.83,40.01 38.1,41.27 38.1,59.69 36.83,60.96 X2.A21 36.83,63.5 38.1,64.77 38.1,88.27 36.83,89.53 X3.A21
N$23
  Top 0.203: X4.A22 ST1.A22
  Bottom 0.203: X4.A22 34.29,16.51 35.56,17.78 35.56,36.2 34.29,37.47 X1.A22 34.29,40.01 35.56,41.27 35.56,59.69 34.29,60.96 X2.A22 34.29,63.5 35.56,64.77 35.56,88.27 34.29,89.53 X3.A22
N$24
  Top 0.203: X4.A23 ST1.A23
  Bottom 0.203: X4.A23 31.75,16.51 33.02,17.78 33.02,36.2 31.75,37.47 X1.A23 31.75,40.01 33.02,41.27 33.02,59.69 31.75,60.96 X2.A23 31.75,63.5 33.02,64.77 33.02,88.27 31.75,89.53 X3.A23
N$25
  Top 0.203: X4.A24 ST1.A24
  Bottom 0.203: X4.A24 29.21,16.51 30.48,17.78 30.48,36.2 29.21,37.47 X1.A24 29.21,40.01 30.48,41.27 30.48,59.69 29.21,60.96 X2.A24 29.21,63.5 30.48,64.77 30.48,88.27 29.21,89.53 X3.A24
N$26
  Top 0.203: X4.A25 ST1.A25
  Bottom 0.203: X4.A25 26.67,16.51 27.94,17.78 27.94,36.2 26.67,37.47 X1.A25 26.67,40.01 27.94,41.27 27.94,59.69 26.67,60.96 X2.A25 26.67,63.5 27.94,64.77 27.94,88.27 26.67,89.53 X3.A25
N$27
  Top 0.203: X4.A26 ST1.A26
  Bottom 0.203: X4.A26 24.13,16.51 25.4,17.78 25.4,36.2 24.13,37.47 X1.A26 24.13,40.01 25.4,41.27 25.4,59.69 24.13,60.96 X2.A26 24.13,63.5 25.4,64.77 25.4,88.27 24.13,89.53 X3.A26
N$28
  Top 0.203: X4.A27 ST1.A27
  Bottom 0.203: X4.A27 21.59,16.51 22.86,17.78 22.86,36.2 21.59,37.47 X1.A27 21.59,40.01 22.86,41.27 22.86,59.69 21.59,60.96 X2.A27 21.59,63.5 22.86,64.77 22.86,88.27 21.59,89.53 X3.A27
N$29
  Top 0.203: X4.A28 ST1.A28
  Bottom 0.203: X4.A28 19.05,16.51 20.32,17.78 20.32,36.2 19.05,37.47 X1.A28 19.05,40.01 20.32,41.27 20.32,59.69 19.05,60.96 X2.A28 19.05,63.5 20.32,64.77 20.32,88.27 19.05,89.53 X3.A28
N$30
  Top 0.203: ST1.A29 16.51,8.26 17.14,8.26 18.41,9.53 18.41,12.07 17.14,13.34 17.14,15.24 X4.A29
  Bottom 0.203: X4.A29 16.51,16.51 17.78,17.78 17.78,36.2 16.51,37.47 X1.A29 16.51,40.01 17.78,41.27 17.78,59.69 16.51,60.96 X2.A29 16.51,63.5 17.78,64.77 17.78,88.27 16.51,89.53 X3.A29
N$31
  Top 0.203: X4.A30 ST1.A30
  Bottom 0.203: X4.A30 13.97,16.51 15.24,17.78 15.24,36.18 14.78,36.64 14.78,36.65 13.97,37.47 X1.A30 13.97,40.01 15.24,41.27 15.24,59.69 13.97,60.96 X2.A30 13.97,63.5 15.24,64.77 15.24,88.27 13.97,89.53 X3.A30
N$32
  Top 0.203: ST1.A31 11.43,8.26 12.06,8.26 13.33,9.53 13.33,12.07 12.06,13.34 12.06,15.24 X4.A31
  Bottom 0.203: X4.A31 11.43,16.51 12.7,17.78 12.7,36.2 11.43,37.47 X1.A31 11.43,40.01 12.7,41.27 12.7,59.69 11.43,60.96 X2.A31 11.43,63.5 12.7,64.77 12.7,88.27 11.43,89.53 X3.A31
N$35
  Bottom 0.203: ST1.B4 80.01,12.7 78.74,13.97 78.74,16.51 80.01,17.78 X4.B4 80.01,36.2 78.74,37.47 78.74,40.01 80.01,41.27 X1.B4 80.01,59.69 78.74,60.96 78.74,63.5 80.01,64.77 X2.B4 80.01,88.27 78.74,89.53 78.74,92.07 80.01,93.34 X3.B4
N$36
  Bottom 0.203: ST1.B5 77.47,12.7 76.2,13.97 76.2,16.51 77.47,17.78 X4.B5 77.47,36.2 76.2,37.47 76.2,40.01 77.47,41.27 X1.B5 77.47,59.69 76.2,60.96 76.2,63.5 77.47,64.77 X2.B5 77.47,88.27 76.2,89.53 76.2,92.07 77.47,93.34 X3.B5
N$37
  Bottom 0.203: ST1.B6 74.93,12.7 73.66,13.97 73.66,16.51 74.93,17.78 X4.B6 74.93,36.2 73.66,37.47 73.66,40.01 74.93,41.27 X1.B6 74.93,59.69 73.66,60.96 73.66,63.5 74.93,64.77 X2.B6 74.93,88.27 73.66,89.53 73.66,92.07 74.93,93.34 X3.B6
N$39
  Bottom 0.203: ST1.B8 69.85,12.7 68.58,13.97 68.58,16.51 69.85,17.78 X4.B8 69.85,36.2 68.58,37.47 68.58,40.01 69.85,41.27 X1.B8 69.85,59.69 68.58,60.96 68.58,63.5 69.85,64.77 X2.B8 69.85,88.27 68.58,89.53 68.58,92.07 69.85,93.34 X3.B8
N$40
  Bottom 0.203: ST1.B9 67.31,12.7 66.04,13.97 66.04,16.51 67.31,17.78 X4.B9 67.31,36.2 66.04,37.47 66.04,40.01 67.31,41.27 X1.B9 67.31,59.69 66.04,60.96 66.04,63.5 67.31,64.77 X2.B9 67.31,88.27 66.04,89.53 66.04,92.07 67.31,93.34 X3.B9
N$41
  Bottom 0.203: ST1.B10 64.77,12.7 63.5,13.97 63.5,16.51 64.77,17.78 X4.B10 64.77,36.2 63.5,37.47 63.5,40.01 64.77,41.27 X1.B10 64.77,59.69 63.5,60.96 63.5,63.5 64.77,64.77 X2.B10 64.77,88.27 63.5,89.53 63.5,92.07 64.77,93.34 X3.B10
N$42
  Bottom 0.203: ST1.B11 62.23,12.7 60.96,13.97 60.96,16.51 62.23,17.78 X4.B11 62.23,36.2 60.96,37.47 60.96,40.01 62.23,41.27 X1.B11 62.23,59.69 60.96,60.96 60.96,63.5 62.23,64.77 X2.B11 62.23,88.27 60.96,89.53 60.96,92.07 62.23,93.34 X3.B11
N$43
  Bottom 0.203: ST1.B12 59.69,12.7 58.42,13.97 58.42,16.51 59.69,17.78 X4.B12 59.69,36.2 58.42,37.47 58.42,40.01 59.69,41.27 X1.B12 59.69,59.69 58.42,60.96 58.42,63.5 59.69,64.77 X2.B12 59.69,88.27 58.42,89.53 58.42,92.07 59.69,93.34 X3.B12
N$44
  Bottom 0.203: ST1.B13 57.15,12.7 55.88,13.97 55.88,16.51 57.15,17.78 X4.B13 57.15,36.2 55.88,37.47 55.88,40.01 57.15,41.27 X1.B13 57.15,59.69 55.88,60.96 55.88,63.5 57.15,64.77 X2.B13 57.15,88.27 55.88,89.53 55.88,92.07 57.15,93.34 X3.B13
N$45
  Bottom 0.203: ST1.B14 54.61,12.7 53.34,13.97 53.34,16.51 54.61,17.78 X4.B14 54.61,36.2 53.34,37.47 53.34,40.01 54.61,41.27 X1.B14 54.61,59.69 53.34,60.96 53.34,63.5 54.61,64.77 X2.B14 54.61,88.27 53.34,89.53 53.34,92.07 54.61,93.34 X3.B14
N$46
  Bottom 0.203: ST1.B15 52.07,12.7 50.8,13.97 50.8,16.51 52.07,17.78 X4.B15 52.07,36.2 50.8,37.47 50.8,40.01 52.07,41.27 X1.B15 52.07,59.69 50.8,60.96 50.8,63.5 52.07,64.77 X2.B15 52.07,88.27 50.8,89.53 50.8,92.07 52.07,93.34 X3.B15
N$47
  Bottom 0.203: ST1.B16 49.53,12.7 48.26,13.97 48.26,16.51 49.53,17.78 X4.B16 49.53,36.2 48.26,37.47 48.26,40.01 49.53,41.27 X1.B16 49.53,59.69 48.26,60.96 48.26,63.5 49.53,64.77 X2.B16 49.53,88.27 48.26,89.53 48.26,92.07 49.53,93.34 X3.B16
N$48
  Bottom 0.203: ST1.B17 46.99,12.7 45.72,13.97 45.72,16.51 46.99,17.78 X4.B17 46.99,36.2 45.72,37.47 45.72,40.01 46.99,41.27 X1.B17 46.99,59.69 45.72,60.96 45.72,63.5 46.99,64.77 X2.B17 46.99,88.27 45.72,89.53 45.72,92.07 46.99,93.34 X3.B17
N$49
  Bottom 0.203: ST1.B18 44.45,12.7 43.18,13.97 43.18,16.51 44.45,17.78 X4.B18 44.45,36.2 43.18,37.47 43.18,40.01 44.45,41.27 X1.B18 44.45,59.69 43.18,60.96 43.18,63.5 44.45,64.77 X2.B18 44.45,88.27 43.18,89.53 43.18,92.07 44.45,93.34 X3.B18
N$50
  Bottom 0.203: ST1.B19 41.91,12.7 40.64,13.97 40.64,16.51 41.91,17.78 X4.B19 41.91,36.2 40.64,37.47 40.64,40.01 41.91,41.27 X1.B19 41.91,59.69 40.64,60.96 40.64,63.5 41.91,64.77 X2.B19 41.91,88.27 40.64,89.53 40.64,92.07 41.91,93.34 X3.B19
N$51
  Bottom 0.203: ST1.B20 39.37,12.7 38.1,13.97 38.1,16.51 39.37,17.78 X4.B20 39.37,36.2 38.1,37.47 38.1,40.01 39.37,41.27 X1.B20 39.37,59.69 38.1,60.96 38.1,63.5 39.37,64.77 X2.B20 39.37,88.27 38.1,89.53 38.1,92.07 39.37,93.34 X3.B20
N$52
  Bottom 0.203: ST1.B21 36.83,12.7 35.56,13.97 35.56,16.51 36.83,17.78 X4.B21 36.83,36.2 35.56,37.47 35.56,40.01 36.83,41.27 X1.B21 36.83,59.69 35.56,60.96 35.56,63.5 36.83,64.77 X2.B21 36.83,88.27 35.56,89.53 35.56,92.07 36.83,93.34 X3.B21
N$53
  Bottom 0.203: ST1.B22 34.29,12.7 33.02,13.97 33.02,16.51 34.29,17.78 X4.B22 34.29,36.2 33.02,37.47 33.02,40.01 34.29,41.27 X1.B22 34.29,59.69 33.02,60.96 33.02,63.5 34.29,64.77 X2.B22 34.29,88.27 33.02,89.53 33.02,92.07 34.29,93.34 X3.B22
N$54
  Bottom 0.203: ST1.B23 31.75,12.7 30.48,13.97 30.48,16.51 31.75,17.78 X4.B23 31.75,36.2 30.48,37.47 30.48,40.01 31.75,41.27 X1.B23 31.75,59.69 30.48,60.96 30.48,63.5 31.75,64.77 X2.B23 31.75,88.27 30.48,89.53 30.48,92.07 31.75,93.34 X3.B23
N$55
  Bottom 0.203: ST1.B24 29.21,12.7 27.94,13.97 27.94,16.51 29.21,17.78 X4.B24 29.21,36.2 27.94,37.47 27.94,40.01 29.21,41.27 X1.B24 29.21,59.69 27.94,60.96 27.94,63.5 29.21,64.77 X2.B24 29.21,88.27 27.94,89.53 27.94,92.07 29.21,93.34 X3.B24
N$56
  Bottom 0.203: ST1.B25 26.67,12.7 25.4,13.97 25.4,16.51 26.67,17.78 X4.B25 26.67,36.2 25.4,37.47 25.4,40.01 26.67,41.27 X1.B25 26.67,59.69 25.4,60.96 25.4,63.5 26.67,64.77 X2.B25 26.67,88.27 25.4,89.53 25.4,92.07 26.67,93.34 X3.B25
N$57
  Bottom 0.203: ST1.B26 24.13,12.7 22.86,13.97 22.86,16.51 24.13,17.78 X4.B26 24.13,36.2 22.86,37.47 22.86,40.01 24.13,41.27 X1.B26 24.13,59.69 22.86,60.96 22.86,63.5 24.13,64.77 X2.B26 24.13,88.27 22.86,89.53 22.86,92.07 24.13,93.34 X3.B26
N$58
  Bottom 0.203: ST1.B27 21.59,12.7 20.32,13.97 20.32,16.51 21.59,17.78 X4.B27 21.59,36.2 20.32,37.47 20.32,40.01 21.59,41.27 X1.B27 21.59,59.69 20.32,60.96 20.32,63.5 21.59,64.77 X2.B27 21.59,88.27 20.32,89.53 20.32,92.07 21.59,93.34 X3.B27
N$59
  Bottom 0.203: ST1.B28 19.05,12.7 17.78,13.97 17.78,16.51 19.05,17.78 X4.B28 19.05,36.2 17.78,37.47 17.78,40.01 19.05,41.27 X1.B28 19.05,59.69 17.78,60.96 17.78,63.5 19.05,64.77 X2.B28 19.05,88.27 17.78,89.53 17.78,92.07 19.05,93.34 X3.B28
N$63
  Top 0.203: 3V3.K 96.52,33.49 97.54,34.5 97.54,37.08 R3.2
N$64
  Top 0.203: R4.2 96.52,35.56 5V.K
N$68
  Bottom 0.203: R5.2 2.54,36.36 1.52,35.35 1.52,25.78 RESET.A
RESET  (via drill 0.66)
  Top 0.203: RESET.K 14.6,24.77 17.78,21.59 17.78,18.41 83.19,18.41 84.46,19.69 84.46,20.32 X4.B2 89.15,24.38 90.59,24.38 91.61,25.4 v93.34,25.4 | R6.1 97.79,22.58 S1.1 | IC5.1 96.52,52.15 IC4.2 93.98,52.07 92.71,53.34 87,53.34 85.09,51.44 X1.B2
  Bottom 0.203: ST1.B2 85.09,12.7 83.82,13.97 83.82,16.51 85.09,17.78 X4.B2 85.09,36.2 83.82,37.47 83.82,40.01 85.09,41.27 X1.B2 85.09,59.69 83.82,60.96 83.82,63.5 85.09,64.77 X2.B2 85.09,88.27 83.82,89.53 83.82,92.07 85.09,93.34 X3.B2 | S1.1 94.41,25.4 v93.34,25.4
RW
  Top 0.203: X4.A1 87.63,13.34 86.36,12.07 86.36,7.62 87.63,7.62 ST1.A1 | X1.A1 86.36,37.47 83.82,37.47 83.19,37.47 81.28,35.56 19.68,35.56 13.97,29.84 RW.K
  Bottom 0.203: X4.A1 87.63,17.78 88.9,19.05 88.9,21.59 87.63,22.86 87.63,32.38 88.9,33.66 88.9,36.2 87.63,37.47 X1.A1 87.63,41.27 88.9,42.55 88.9,59.69 87.63,60.96 X2.A1 87.63,63.5 88.9,64.77 88.9,89.53 X3.A1
VCC
  Bottom 0.203: S3.2 8.81,76.12 J1.1

### Text on the board
tNames: GND | GND | GND | GND | GND | GND | RST